# EAGLE design ACme++ (EAGLE 6.5.0)
AUTHOR: Brad Campbell; REV: A; TITLE: ACme++

## Sheet 1 of 4: EPIC & Programmer
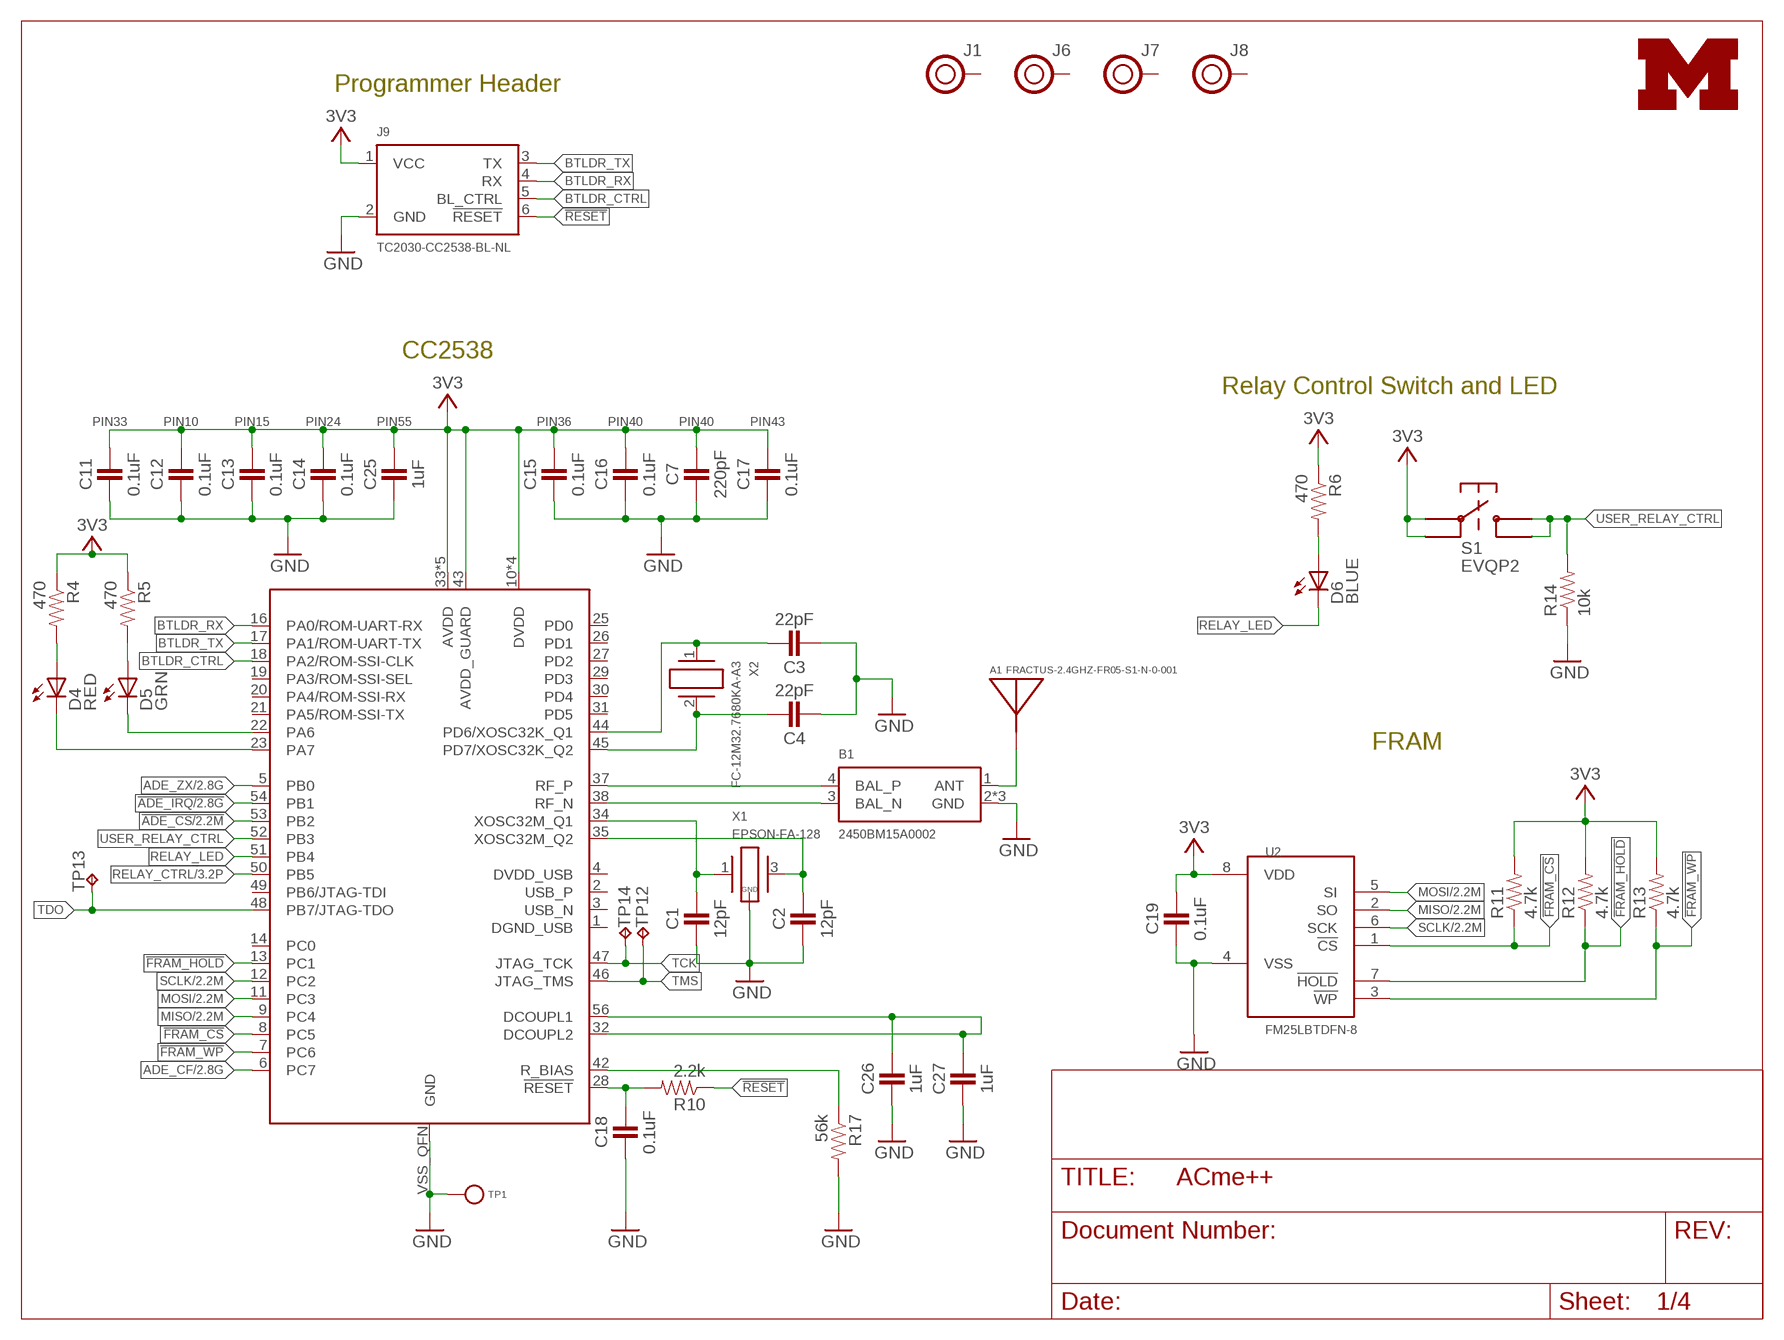
[diagram p0: schematic, sheet 1]

### Parts
A1  FRACTUS-2.4GHZ-FR05-S1-N-0-001  [FRACTUS-ANTENNA-FR05-S1-N-0-001]
B1  2450BM15A0002  [2450BM]
C1  12pF  CAPACITOR  [0402_CAP]
C2  12pF  CAPACITOR  [0402_CAP]
C3  22pF  CAPACITOR  [0402_CAP]
C4  22pF  CAPACITOR  [0402_CAP]
C7  220pF  CAPACITOR  [0402_CAP]
C11  0.1uF  CAPACITOR  [0402_CAP]
C12  0.1uF  CAPACITOR  [0402_CAP]
C13  0.1uF  CAPACITOR  [0402_CAP]
C14  0.1uF  CAPACITOR  [0402_CAP]
C15  0.1uF  CAPACITOR  [0402_CAP]
C16  0.1uF  CAPACITOR  [0402_CAP]
C17  0.1uF  CAPACITOR  [0402_CAP]
C18  0.1uF  CAPACITOR  [0402_CAP]
C19  0.1uF  CAPACITOR  [0402_CAP]
C25  1uF  CAPACITOR  [0402_CAP]
C26  1uF  CAPACITOR  [0402_CAP]
C27  1uF  CAPACITOR  [0402_CAP]
D4  RED  LED0603  [LED-0603]
D5  GRN  LED0603  [LED-0603]
D6  BLUE  LED0603  [LED-0603]
J1  HOLE  [HOLE-0.125]
J6  HOLE  [HOLE-0.125]
J7  HOLE  [HOLE-0.125]
J8  HOLE  [HOLE-0.125]
J9  TC2030-CC2538-BL-NL  [TC2030-IDC-NL]
R4  470  RESISTOR  [0402_RES]
R5  470  RESISTOR  [0402_RES]
R6  470  RESISTOR  [0402_RES]
R10  2.2k  RESISTOR  [0402_RES]
R11  4.7k  RESISTOR  [0402_RES]
R12  4.7k  RESISTOR  [0402_RES]
R13  4.7k  RESISTOR  [0402_RES]
R14  10k  RESISTOR0603-RES  [0603-RES]
R17  56k  RESISTOR  [0402_RES]
S1  EVQP2  [EVQP2]
TP1  TEST_POINT_0.040IN  [TESTPOINT_0.040IN]
TP12  TPTP09SQ  [TP09SQ]
TP13  TPTP09SQ  [TP09SQ]
TP14  TPTP09SQ  [TP09SQ]
U1  CC2538  [S-PVQFN-N56]
U2  FM25LBTDFN-8  [TDFN-8]
U$3  UMICH_SOLID_MEDIUM  [UMICH_SOLID_200MIL]
X1  EPSON-FA-128  [FA-128]
X2  FC-12M32.7680KA-A3  [FC-12M]

### Nets
3V3: C7.1 C11.1 C12.1 C13.1 C14.1 C15.1 C16.1 C17.1 C19.1 C25.1 J9.1(VCC) R4.1 R5.1 R6.1 R11.2 R12.2 R13.2 S1.P$1 S1.P$3 U1.10(DVDD) U1.15(DVDD) U1.24(DVDD) U1.33(AVDD) U1.36(AVDD) U1.39(AVDD) U1.40(AVDD) U1.41(AVDD) U1.43(AVDD_GUARD) U1.55(DVDD) U2.8(VDD) ; also sheet 2,3,4
!ADE_CS: U1.53(PB2) ; also sheet 2
!ADE_IRQ: U1.54(PB1) ; also sheet 2
!FRAM_CS: R11.1 U1.8(PC5) U2.1(!CS)
!FRAM_HOLD: R12.1 U1.13(PC1) U2.7(!HOLD)
!FRAM_WP: R13.1 U1.7(PC6) U2.3(!WP)
!RESET: J9.6(!RESET) R10.1
ADE_CF: U1.6(PC7) ; also sheet 2
ADE_ZX: U1.5(PB0) ; also sheet 2
ANTENNA: A1.1(ANTENNA) B1.1(ANT)
BTLDR_CTRL: J9.5(BL_CTRL) U1.18(PA2/ROM-SSI-CLK)
BTLDR_RX: J9.4(RX) U1.16(PA0/ROM-UART-RX)
BTLDR_TX: J9.3(TX) U1.17(PA1/ROM-UART-TX)
GND: B1.2(GND) B1.5(GND) B1.6(GND) C1.2 C2.2 C3.2 C4.2 C7.2 C11.2 C12.2 C13.2 C14.2 C15.2 C16.2 C17.2 C18.2 C19.2 C25.2 C26.2 C27.2 J9.2(GND) R14.1 R17.2 TP1.TESTPOINT U1.VSS_QFN(GND) U2.4(VSS) X1.2(GND) X1.4(GND) ; also sheet 2,3,4
GREEN_LED: D5.C U1.22(PA6)
MISO: U1.9(PC4) U2.2(SO) ; also sheet 2
MOSI: U1.11(PC3) U2.5(SI) ; also sheet 2
N$1: C26.1 C27.1 U1.32(DCOUPL2) U1.56(DCOUPL1)
N$2: C18.1 R10.2 U1.28(!RESET)
N$6: C4.1 U1.45(PD7/XOSC32K_Q2) X2.2
N$7: C3.1 U1.44(PD6/XOSC32K_Q1) X2.1
N$8: R17.1 U1.42(R_BIAS)
N$9: C1.1 U1.34(XOSC32M_Q1) X1.1
N$10: C2.1 U1.35(XOSC32M_Q2) X1.3
N$12: D6.A R6.2
N$20: D4.A R4.2
N$22: D5.A R5.2
RED_LED: D4.C U1.23(PA7)
RELAY_CTRL: U1.50(PB5) ; also sheet 3
RELAY_LED: D6.C U1.51(PB4)
RF_N: B1.3(BAL_N) U1.38(RF_N)
RF_P: B1.4(BAL_P) U1.37(RF_P)
SCLK: U1.12(PC2) U2.6(SCK) ; also sheet 2
TCK: TP14.TP U1.47(JTAG_TCK)
TDO: TP13.TP U1.48(PB7/JTAG-TDO)
TMS: TP12.TP U1.46(JTAG_TMS)
USER_RELAY_CTRL: R14.2 S1.P$2 S1.P$4 U1.52(PB3)
Unconnected: J1.1 J6.1 J7.1 J8.1 U1.1(DGND_USB) U1.2(USB_P) U1.3(USB_N) U1.4(DVDD_USB) U1.14(PC0) U1.19(PA3/ROM-SSI-SEL) U1.20(PA4/ROM-SSI-RX) U1.21(PA5/ROM-SSI-TX) U1.25(PD0) U1.26(PD1) U1.27(PD2) U1.29(PD3) U1.30(PD4) U1.31(PD5) U1.49(PB6/JTAG-TDI)

### Notes on the sheet
- Programmer Header
- CC2538
- Relay Control Switch and LED
- PIN33 | PIN10 | PIN15 | PIN24 | PIN55 | PIN36 | PIN40 | PIN40 | PIN43
- FRAM

## Sheet 2 of 4: ADE7753
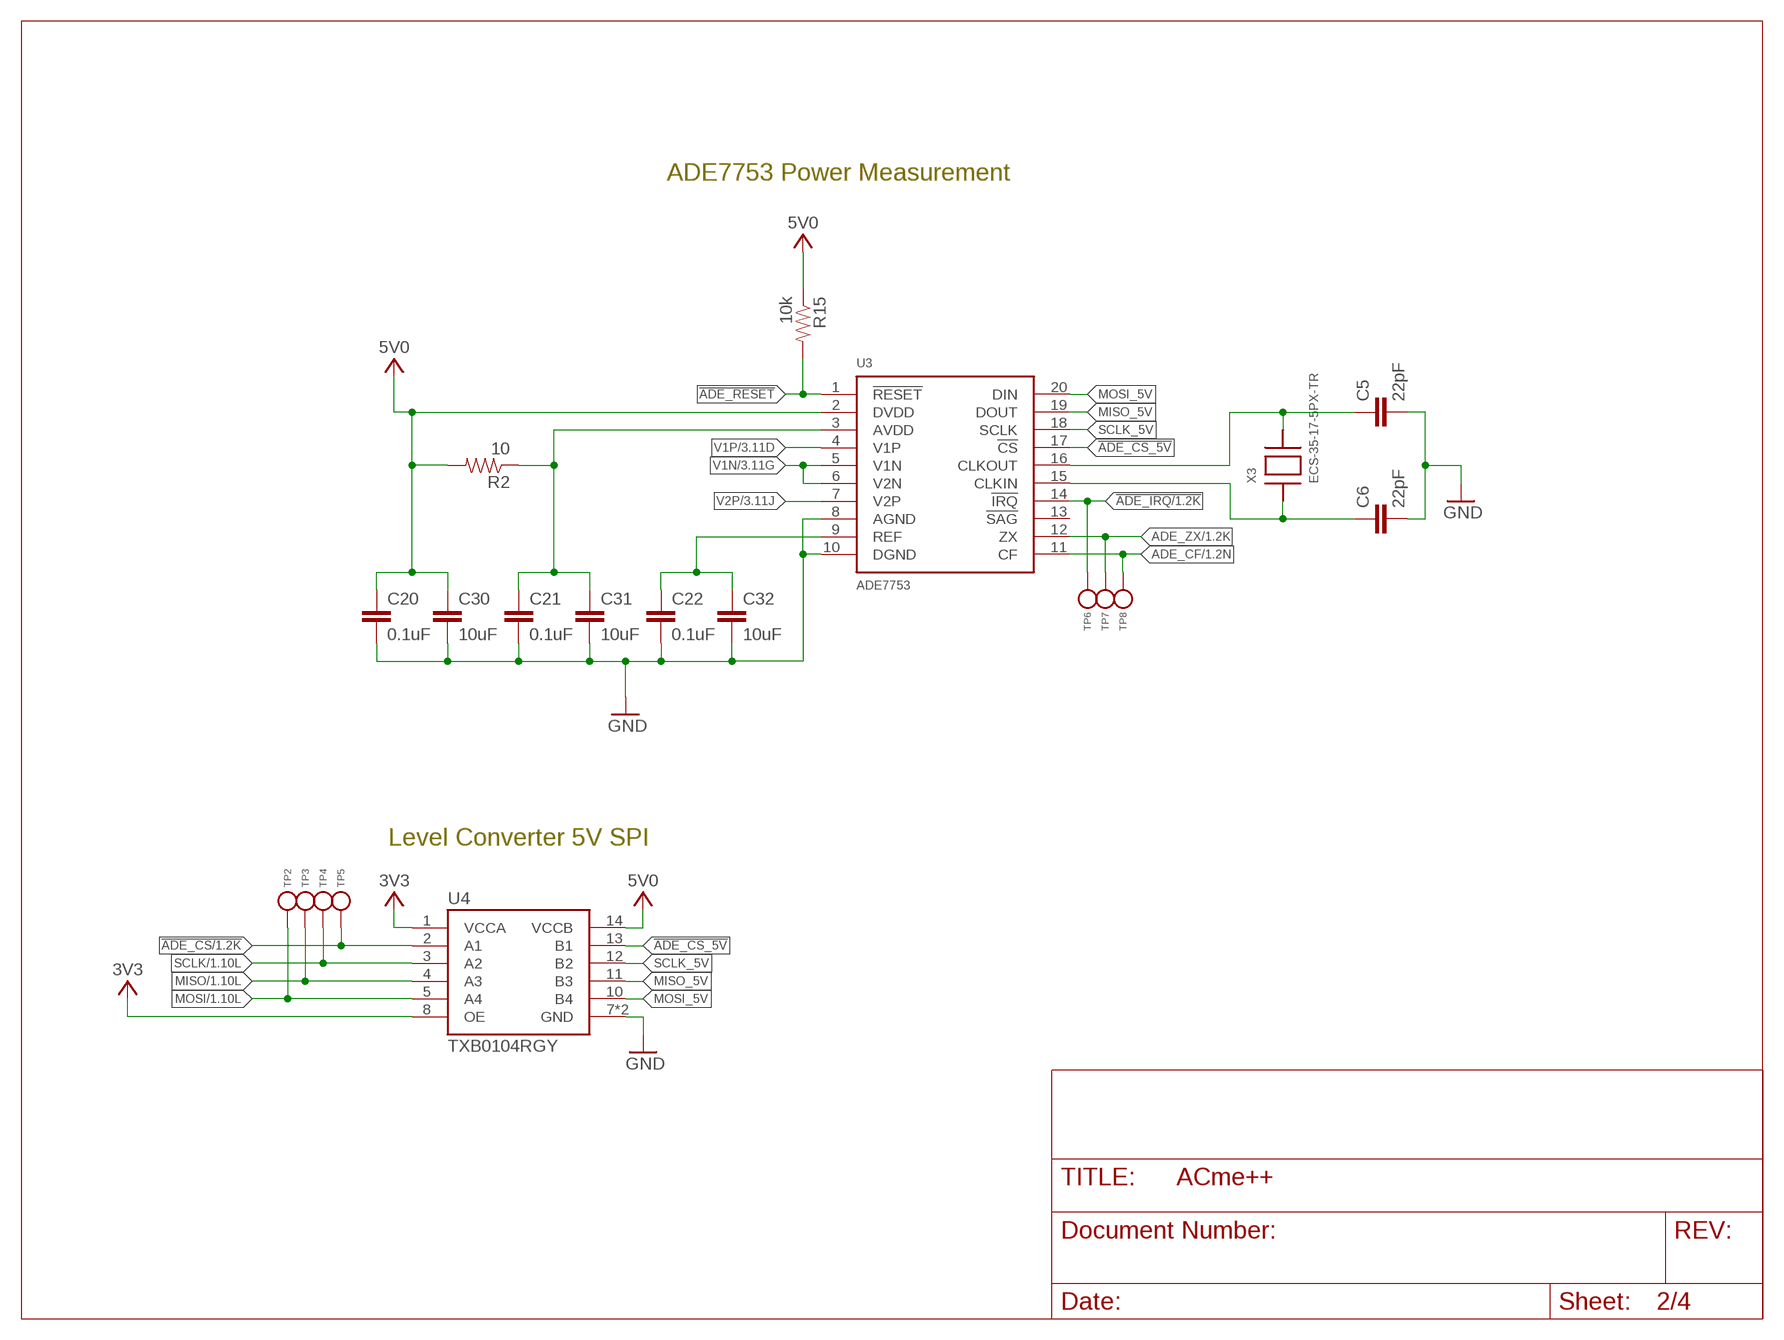
[diagram p1: schematic, sheet 2]

### Parts
C5  22pF  CAP0603-CAP  [0603-CAP]
C6  22pF  CAP0603-CAP  [0603-CAP]
C20  0.1uF  CAP0603-CAP  [0603-CAP]
C21  0.1uF  CAP0603-CAP  [0603-CAP]
C22  0.1uF  CAP0603-CAP  [0603-CAP]
C30  10uF  CAP0603-CAP  [0603-CAP]
C31  10uF  CAP0603-CAP  [0603-CAP]
C32  10uF  CAP0603-CAP  [0603-CAP]
R2  10  RESISTOR0603-RES  [0603-RES]
R15  10k  RESISTOR0603-RES  [0603-RES]
TP2  TEST_POINT_0.040IN  [TESTPOINT_0.040IN]
TP3  TEST_POINT_0.040IN  [TESTPOINT_0.040IN]
TP4  TEST_POINT_0.040IN  [TESTPOINT_0.040IN]
TP5  TEST_POINT_0.040IN  [TESTPOINT_0.040IN]
TP6  TEST_POINT_0.040IN  [TESTPOINT_0.040IN]
TP7  TEST_POINT_0.040IN  [TESTPOINT_0.040IN]
TP8  TEST_POINT_0.040IN  [TESTPOINT_0.040IN]
U3  ADE7753  [SSOP-20]
U4  TXB0104RGY  [S-PVQFN-N14]
X3  ECS-35-17-5PX-TR  [CSM-7X]

### Nets
3V3: U4.1(VCCA) U4.8(OE) ; also sheet 1,3,4
5V0: C20.1 C30.1 R2.2 R15.1 U3.2(DVDD) U4.14(VCCB) ; also sheet 3,4
!ADE_CS: TP5.TESTPOINT U4.2(A1) ; also sheet 1
!ADE_CS_5V: U3.17(!CS) U4.13(B1)
!ADE_IRQ: TP6.TESTPOINT U3.14(!IRQ) ; also sheet 1
!ADE_RESET: R15.2 U3.1(!RESET)
ADE_AVDD: C21.1 C31.1 R2.1 U3.3(AVDD)
ADE_CF: TP8.TESTPOINT U3.11(CF) ; also sheet 1
ADE_ZX: TP7.TESTPOINT U3.12(ZX) ; also sheet 1
GND: C5.2 C6.2 C20.2 C21.2 C22.2 C30.2 C31.2 C32.2 U3.8(AGND) U3.10(DGND) U4.7(GND) U4.THERMALPAD(GND) ; also sheet 1,3,4
MISO: TP3.TESTPOINT U4.4(A3) ; also sheet 1
MISO_5V: U3.19(DOUT) U4.11(B3)
MOSI: TP2.TESTPOINT U4.5(A4) ; also sheet 1
MOSI_5V: U3.20(DIN) U4.10(B4)
N$3: C6.1 U3.15(CLKIN) X3.1
N$11: C22.1 C32.1 U3.9(REF)
N$15: C5.1 U3.16(CLKOUT) X3.2
SCLK: TP4.TESTPOINT U4.3(A2) ; also sheet 1
SCLK_5V: U3.18(SCLK) U4.12(B2)
V1N: U3.5(V1N) U3.6(V2N) ; also sheet 3
V1P: U3.4(V1P) ; also sheet 3
V2P: U3.7(V2P) ; also sheet 3
Unconnected: U3.13(!SAG)

### Notes on the sheet
- ADE7753 Power Measurement
- Level Converter 5V SPI

## Sheet 3 of 4: Relay
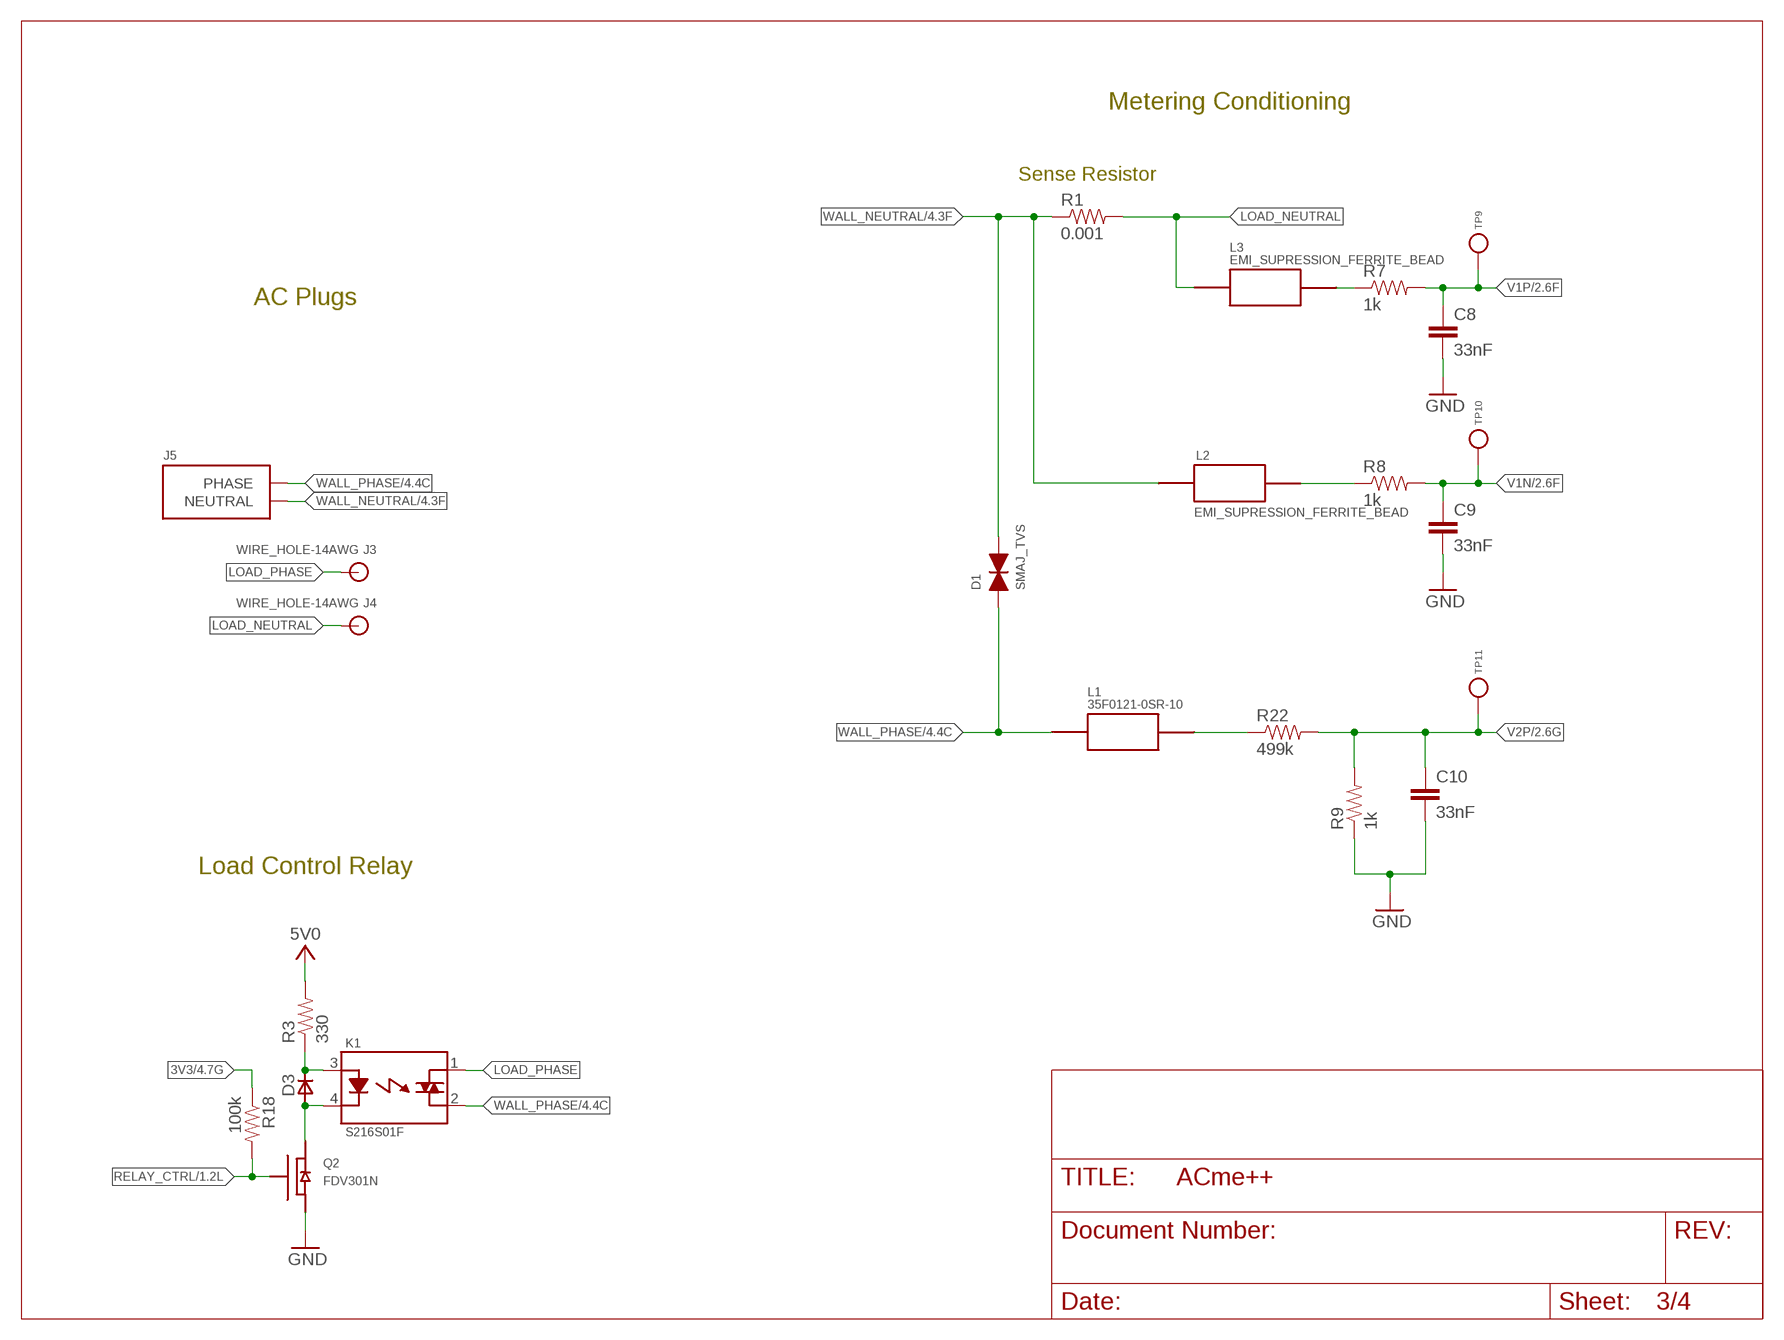
[diagram p2: schematic, sheet 3]

### Parts
C8  33nF  CAP0805  [0805]
C9  33nF  CAP0805  [0805]
C10  33nF  CAP0805  [0805]
D1  SMAJ_TVS  [DO214_TVS]
D3  DIODE_MMBD914  [SOT-23]
J3  WIRE_HOLE-14AWG  [WIRE_HOLE-14AWG]
J4  WIRE_HOLE-14AWG  [WIRE_HOLE-14AWG]
J5  AC-PLUG-2  [AC_MALE_PINS_2]
K1  S216S01F  [RELAY_SX16S0X]
L1  35F0121-0SR-10  [35F0102]
L2  EMI_SUPRESSION_FERRITE_BEAD  [L1806]
L3  EMI_SUPRESSION_FERRITE_BEAD  [L1806]
Q2  FDV301N  [SOT-23]
R1  0.001  RESISTOR2512  [R2512]
R3  330  RESISTOR0805-RES  [0805]
R7  1k  RESISTOR0805-RES  [0805]
R8  1k  RESISTOR0805-RES  [0805]
R9  1k  RESISTOR0805-RES  [0805]
R18  100k  RESISTOR0603-RES  [0603-RES]
R22  499k  RESISTOR0805-RES  [0805]
TP9  TEST_POINT_0.040IN  [TESTPOINT_0.040IN]
TP10  TEST_POINT_0.040IN  [TESTPOINT_0.040IN]
TP11  TEST_POINT_0.040IN  [TESTPOINT_0.040IN]

### Nets
3V3: R18.1 ; also sheet 1,2,4
5V0: R3.2 ; also sheet 2,4
GND: C8.2 C9.2 C10.2 Q2.2(S) R9.1 ; also sheet 1,2,4
LOAD_NEUTRAL: J4.P$1 L3.P$1 R1.2
LOAD_PHASE: J3.P$1 K1.1
N$4: D3.1(ANNODE) K1.4 Q2.3(D)
N$13: D3.3(CATHODE) K1.3 R3.1
N$14: L2.P$2 R8.1
N$16: L3.P$2 R7.1
N$17: L1.2 R22.1
RELAY_CTRL: Q2.1(G) R18.2 ; also sheet 1
V1N: C9.1 R8.2 TP10.TESTPOINT ; also sheet 2
V1P: C8.1 R7.2 TP9.TESTPOINT ; also sheet 2
V2P: C10.1 R9.2 R22.2 TP11.TESTPOINT ; also sheet 2
WALL_NEUTRAL: D1.CATHODE J5.NEUTRAL1(NEUTRAL) J5.NEUTRAL2(NEUTRAL) L2.P$1 R1.1 ; also sheet 4
WALL_PHASE: D1.ANODE J5.PHASE1(PHASE) J5.PHASE2(PHASE) K1.2 L1.1 ; also sheet 4

### Notes on the sheet
- Metering Conditioning
- Sense Resistor
- AC Plugs
- Load Control Relay

## Sheet 4 of 4: AC-DC
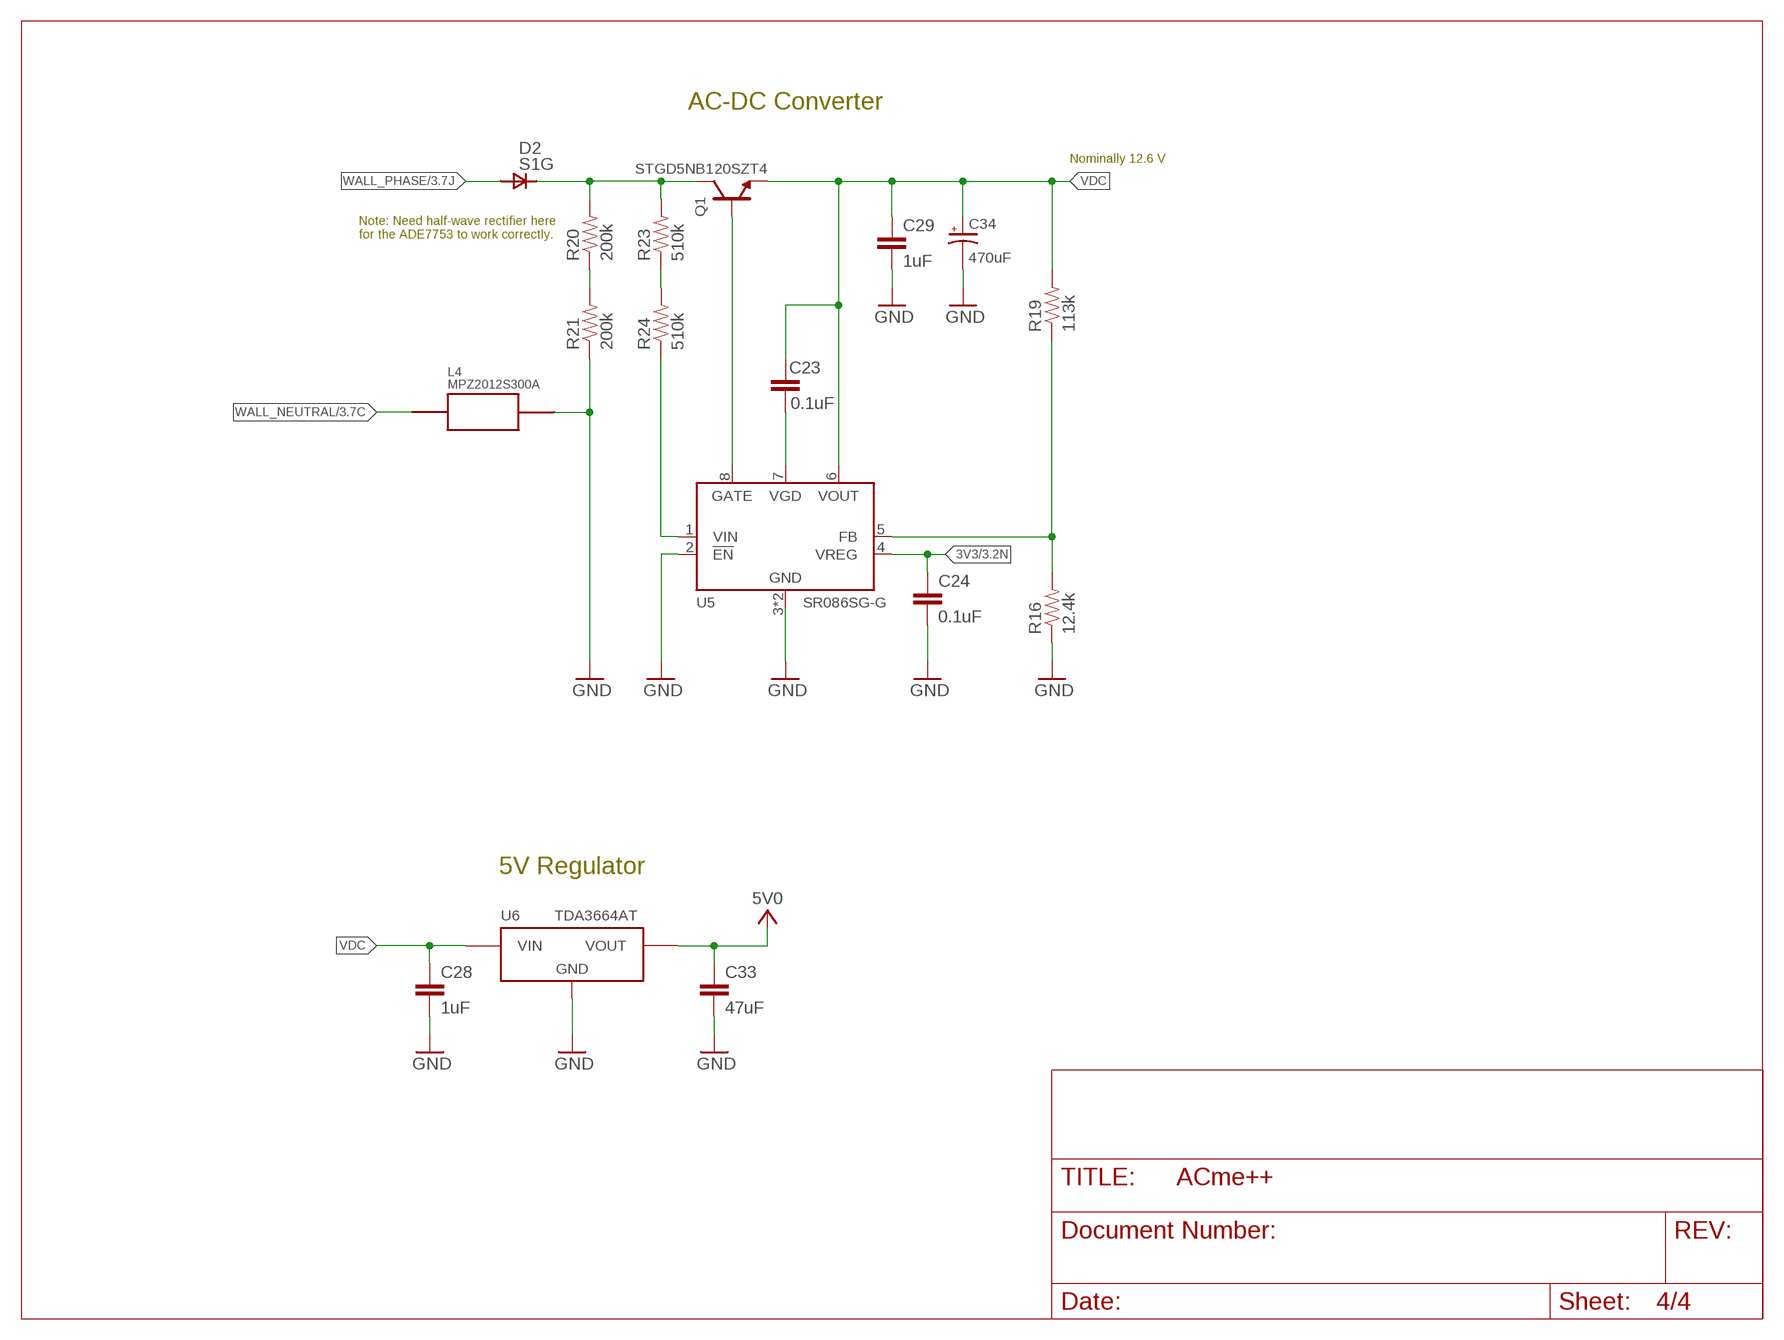
[diagram p3: schematic, sheet 4]

### Parts
C23  0.1uF  CAP0603-CAP  [0603-CAP]
C24  0.1uF  CAP0603-CAP  [0603-CAP]
C28  1uF  CAP0603-CAP  [0603-CAP]
C29  1uF  CAP1206  [1206]
C33  47uF  CAP1206  [1206]
C34  470uF  CAP_EEE-FP1E471AP  [CAP_SM_10MM]
D2  S1G  [DO-214AC]
L4  MPZ2012S300A  [0805_RESISTOR]
Q1  STGD5NB120SZT4  [DPAK]
R16  12.4k  RESISTOR0603-RES  [0603-RES]
R19  113k  RESISTOR0603-RES  [0603-RES]
R20  200k  RESISTOR1206  [1206]
R21  200k  RESISTOR1206  [1206]
R23  510k  RESISTOR1206  [1206]
R24  510k  RESISTOR1206  [1206]
U5  SR086SG-G  [SR086]
U6  TDA3664AT  [SOIC_8]

### Nets
3V3: C24.1 U5.4(VREG) ; also sheet 1,2,3
5V0: C33.1 U6.1(VOUT) ; also sheet 2,3
DC_RECTIFIED: D2.CATHODE Q1.P$2(C) R20.2 R23.2
GND: C24.2 C28.2 C29.2 C33.2 C34.- L4.P$2 R16.1 R21.1 U5.2(!EN) U5.3(GND) U5.PAD(GND) U6.3(GND) ; also sheet 1,2,3
N$18: R20.1 R21.2
N$21: R23.1 R24.2
N$24: C23.2 U5.7(VGD)
N$26: R16.2 R19.1 U5.5(FB)
SR086_GATE: Q1.P$1(G) U5.8(GATE)
SR086_VIN: R24.1 U5.1(VIN)
VDC: C23.1 C28.1 C29.1 C34.+ Q1.P$3(E) R19.2 U5.6(VOUT) U6.8(VIN)
WALL_NEUTRAL: L4.P$1 ; also sheet 3
WALL_PHASE: D2.ANNODE ; also sheet 3

### Notes on the sheet
- AC-DC Converter
- Nominally 12.6 V
- Note: Need half-wave rectifier here
  for the ADE7753 to work correctly.
- 5V Regulator

## Library data of the parts
A1 = chips:FRACTUS-2.4GHZ-FR05-S1-N-0-001: Fractus Reach Xtend Bluetooth®, Zigbee®, 802.11 b/g/n WLAN Chip Antenna; RICHARDSON_RFPD: FR05-S1-N-0001B
B1 = chips:2450BM15A0002: BALUN JTI MATCHED ZIGBEE; DIGIKEY: 712-1536-1-ND
C1 C2 = passives:CAPACITOR: 0402 Capacitor; DIGIKEY: 445-1236-1-ND
C3 C4 = passives:CAPACITOR: 0402 Capacitor; DIGIKEY: 490-5868-1-ND
C5 C6 = SparkFun-Passives:CAP: Capacitor Standard 0603 ceramic capacitor, and 0.1" leaded capacitor.; DIGIKEY: 445-1273-1-ND
C7 = passives:CAPACITOR: 0402 Capacitor; DIGIKEY: 445-1251-1-ND
C8-C10 = SparkFun-Passives:CAP: Capacitor Standard 0603 ceramic capacitor, and 0.1" leaded capacitor.; DIGIKEY: 478-1389-1-ND
C11-C19 = passives:CAPACITOR: 0402 Capacitor; DIGIKEY: 445-1265-1-ND
C20-C24 = SparkFun-Passives:CAP: Capacitor Standard 0603 ceramic capacitor, and 0.1" leaded capacitor.; DIGIKEY: 445-1316-1-ND
C25-C27 = passives:CAPACITOR: 0402 Capacitor; DIGIKEY: 445-4998-1-ND
C28 = SparkFun-Passives:CAP: Capacitor Standard 0603 ceramic capacitor, and 0.1" leaded capacitor.; DIGIKEY: 445-5956-1-ND
C29 = SparkFun-Passives:CAP: Capacitor Standard 0603 ceramic capacitor, and 0.1" leaded capacitor.; DIGIKEY: 445-1381-1-ND
C30-C32 = SparkFun-Passives:CAP: Capacitor Standard 0603 ceramic capacitor, and 0.1" leaded capacitor.; DIGIKEY: 1276-1119-1-ND
C33 = SparkFun-Passives:CAP: Capacitor Standard 0603 ceramic capacitor, and 0.1" leaded capacitor.; DIGIKEY: 399-5508-1-ND
C34 = powercube:CAP_EEE-FP1E471AP: Surface mount low ESR cap.; DIGIKEY: PCE4440CT-ND
D1 = powercube:SMAJ_TVS; DIGIKEY: SMAJ250CALFCT-ND
D2 = powercube:S1G: Diode 400V 1A SMA; DIGIKEY: S1GFSCT-ND
D3 = powercube:DIODE_MMBD914: DIODE SML SIG 100V 0.2A SOT23-3; DIGIKEY: MMBD914FSCT-ND
D4 = SparkFun-LED:LED: LEDs Standard schematic elements and footprints for 5mm, 3mm, 1206, and 0603 sized LEDs. 5mm - Spark Fun Electronics SKU : COM-00529 (and others); DIGIKEY: 160-1835-1-ND
D5 = SparkFun-LED:LED: LEDs Standard schematic elements and footprints for 5mm, 3mm, 1206, and 0603 sized LEDs. 5mm - Spark Fun Electronics SKU : COM-00529 (and others); DIGIKEY: 160-1834-1-ND
D6 = SparkFun-LED:LED: LEDs Standard schematic elements and footprints for 5mm, 3mm, 1206, and 0603 sized LEDs. 5mm - Spark Fun Electronics SKU : COM-00529 (and others); DIGIKEY: 160-1837-1-ND
J1 J6-J8 = powercube:HOLE: 0.125" PCB Hole with ring
J3 J4 = powercube:WIRE_HOLE-14AWG: Solder point for 14AWG wire
J5 = powercube:AC-PLUG-2: For use with Bud Industries Box: 377-1709-ND
J9 = connector:TC2030-CC2538-BL: Tag connect programmer for the CC2538 bootloader. The RX/TX switch happens on the programmer board, so when using this connect the TX pin to the TX pin on the CC2538 and same for the RX.
K1 = powercube:S216S01F: RELAY SSR 240VAC 16A TRIAC 4-SIP; DIGIKEY: 425-2413-5-ND; MOUSER: 852-S216S01F; NEWARK: 14N9591
L1 = powercube:35F0121-0SR-10: FERRITE 10A 42 OHMS @ 10 MHZ SMD; DIGIKEY: 240-2520-1-ND
L2 L3 = powercube:EMI_SUPRESSION_FERRITE_BEAD: FERRITE 300MA 150 OHM 1806 SMD; DIGIKEY: 240-2418-1-ND
L4 = powercube:MPZ2012S300A: FERRITE CHIP 30 OHM 6A 0805; DIGIKEY: 445-1566-1-ND
Q1 = powercube:STGD5NB120SZ: 5 A - 1200 V - low drop internally clamped IGBT; DIGIKEY: 497-4352-1-ND
Q2 = powercube:FDV301N; DIGIKEY: FDV301NCT-ND
R1 = SparkFun-Resistors:RESISTOR: Resistor; DIGIKEY: P1.0TCT-ND
R2 = SparkFun:RESISTOR: Resistor; DIGIKEY: RHM10.0CFCT-ND
R3 = SparkFun-Resistors:RESISTOR: Resistor; DIGIKEY: RHM330KCT-ND
R4-R6 = passives:RESISTOR: Resistor; DIGIKEY: RHM470BHCT-ND
R7-R9 = SparkFun-Resistors:RESISTOR: Resistor; DIGIKEY: P16058CT-ND
R10 = passives:RESISTOR: Resistor; DIGIKEY: RHM2.2KCECT-ND
R11-R13 = passives:RESISTOR: Resistor; DIGIKEY: RHM4.7KCECT-ND
R14 R15 = SparkFun:RESISTOR: Resistor; DIGIKEY: RHM10.0KCFCT-ND
R16 = SparkFun-Resistors:RESISTOR: Resistor; DIGIKEY: RHM12.4KCFCT-ND
R17 = passives:RESISTOR: Resistor; DIGIKEY: RHM56KBHCT-ND
R18 = SparkFun:RESISTOR: Resistor; DIGIKEY: RHM100KCGCT-ND
R19 = SparkFun-Resistors:RESISTOR: Resistor; DIGIKEY: RHM113KCFCT-ND
R20 R21 = SparkFun-Resistors:RESISTOR: Resistor; DIGIKEY: P200KALCT-ND
R22 = SparkFun-Resistors:RESISTOR: Resistor; DIGIKEY: P499KCCT-ND
R23 R24 = SparkFun-Resistors:RESISTOR: Resistor; DIGIKEY: P510KALCT-ND
S1 = epic:EVQP2; DIGIKEY: P11084SCT-ND
TP1-TP11 = headers:TEST_POINT_0.040IN: 0.040in Test Point; DIGIKEY: 5001K-ND
TP12-TP14 = testpad:TP: Test pad
U1 = chips:CC2538: A Powerful System-On-Chip for 2.4-GHz IEEE 802.15.4, 6LoWPAN and ZigBee Applications; DIGIKEY: 296-35797-1-ND; MOUSER: 595-CC2538SF53RTQT; NEWARK: 87W7713
U2 = chips:FM25LB: IC FRAM 4KBIT 10MHZ 8SOIC; DIGIKEY: FM25L04B-DGRA-ND; MOUSER: 877-FM25L04B-DG
U3 = powercube:ADE7753: Single-Phase Multifunction Metering IC; DIGIKEY: ADE7753ARSZRLCT-ND; MOUSER: 584-ADE7753ARSZR; NEWARK: 59K0984
U4 = chips:TXB0104: 4-BIT BIDIRECTIONAL VOLTAGE-LEVEL TRANSLATOR; DIGIKEY: 296-21930-1-ND
U5 = powercube:SR086: Adjustable Off-Line Inductorless Switching Regulator; MOUSER: 689-SR086SG-G
U6 = powercube:TDA3664: Very low dropout voltage/quiescent current 5 V voltage regulator; DIGIKEY: 568-3310-1-ND; MOUSER: 771-TDA3664ATN1118
U$3 = logos:UMICH_SOLID
X1 = crystals:EPSON-FA-128: MHz RANGE CRYSTAL UNIT ULTRA MINIATURE SIZE LOW PROFILE SMD http://www.digikey.com/product-search/en?FV=ffec63d1; DIGIKEY: SER3800CT-ND; MOUSER: 732-FA128-32F20X-K3
X2 = crystals:FC-12M: kHz RANGE CRYSTAL UNIT; DIGIKEY: SER3672CT-ND
X3 = powercube:ECS-35-17-5PX-TR: CRYSTAL 3.579545MHZ 17PF SMD; DIGIKEY: XC1234CT-ND

## Net classes
1 ac phase: width 2.032 mm, drill 1.524 mm

## Board
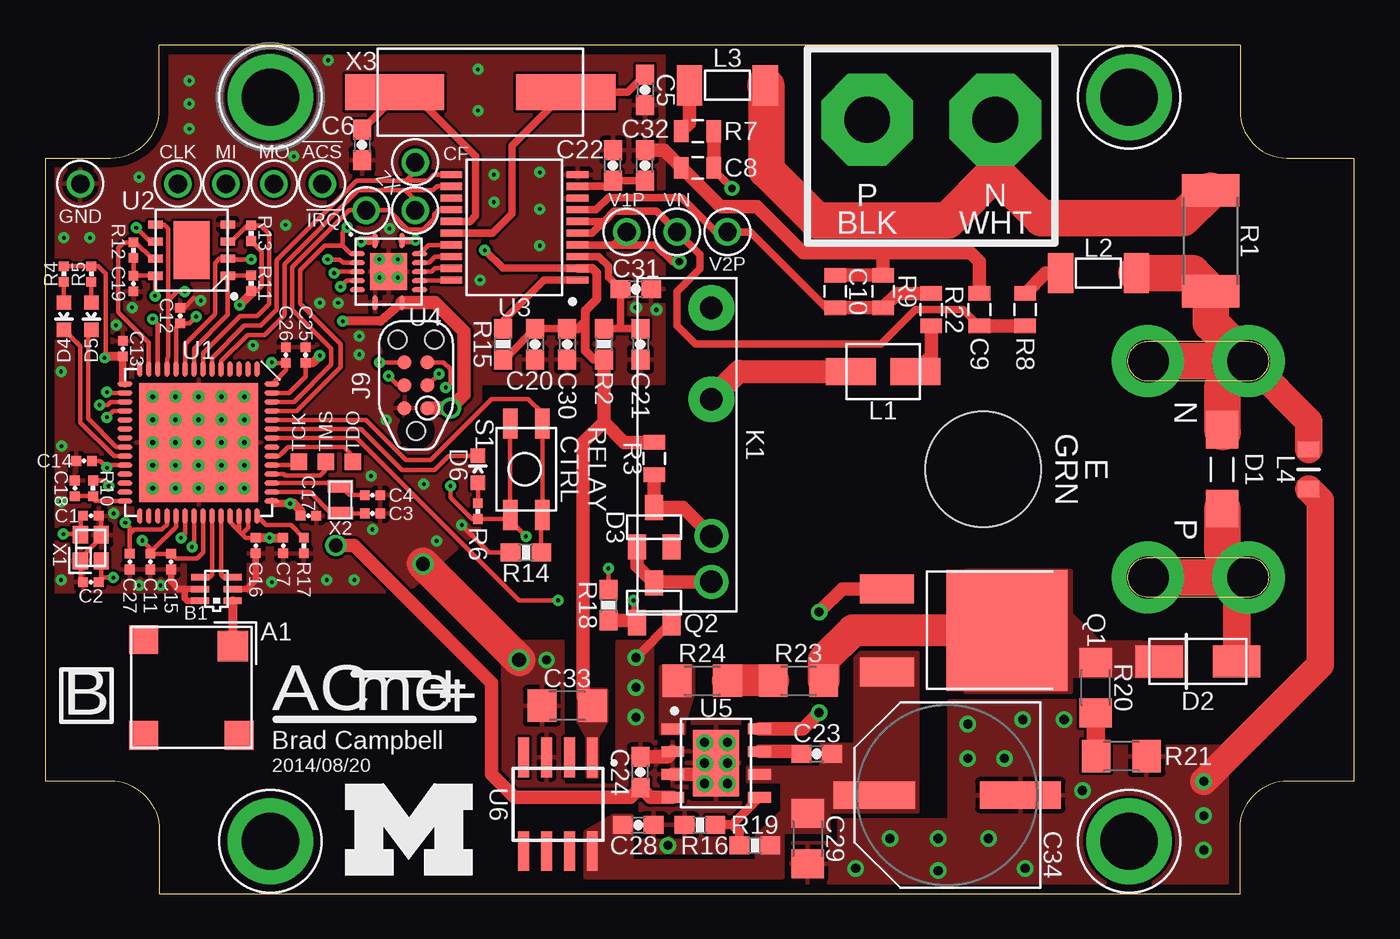
[diagram p4: board, top side]
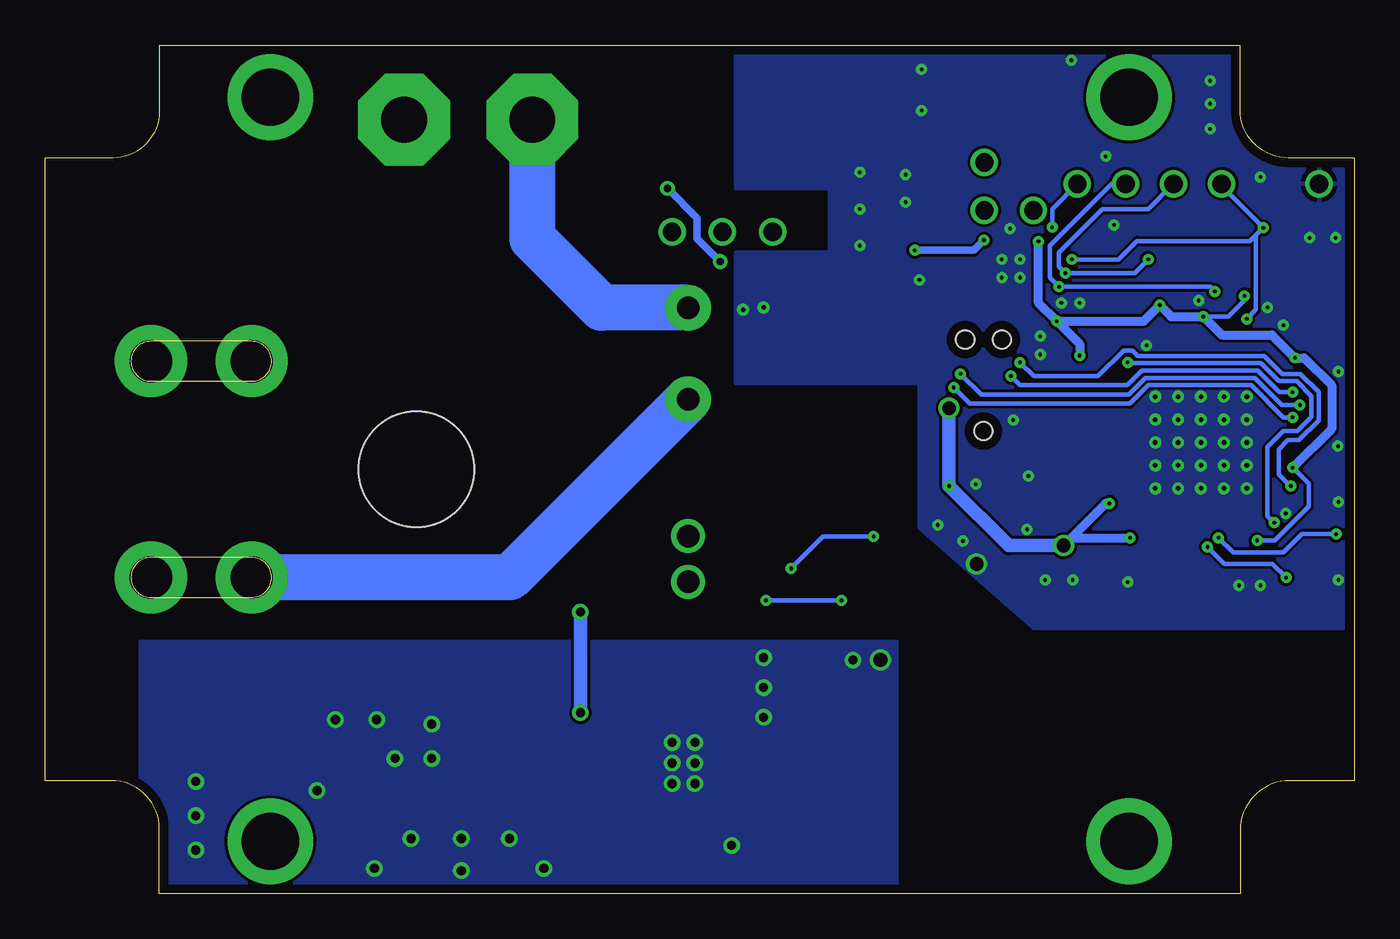
[diagram p5: board, bottom side, seen from below]

Size 72.62 x 47.07 mm. Coordinates in mm from the lower left corner, seen from the top.
Outline: 6.34,0 66.28,0 66.28,3.6 arc-90 68.94,6.26 72.62,6.26 72.62,40.8 68.87,40.8 arc-90 66.28,43.39 66.28,47.07 6.34,47.07 6.34,43.49 arc-90 3.65,40.8 0,40.8 0,6.26 3.58,6.26 arc-90 6.34,3.51 6.34,0
Copper layers (1*16): Top 0.0178mm / dielectric 59mil / Bottom 0.0178mm
Design rules "sunstone-2lyr_v1.0.0.3 *": minimum track width 6mil, minimum drill 14mil, track to track 6mil, track to pad 6mil, pad to pad 6mil, via to via 6mil, smd to smd 6mil, copper to edge 20mil, drill to drill 16mil, minimum pad ring 8mil, minimum via ring 8mil, stop-mask expansion 3mil, vias tented up to drill 100mil, thermal gap 10mil

### Footprints (pad centres in the part's own frame; a part is rotated, then mirrored left to right if it is on the bottom)
FRACTUS-ANTENNA-FR05-S1-N-0-001 = smd 1.7 x 1.7: 1 2.3,-2.3 | smd 1.6 x 1.6: 2 2.65,2.65; 3 -2.65,-2.65; 4 -2.65,2.65
2450BM = smd 0.35 x 1: 1 0.65,0.9; 2 0,0.9; 3 -0.65,0.9; 4 -0.65,-0.9; 5 0,-0.9; 6 0.65,-0.9
0402_CAP = smd 0.536 x 0.546: 1 -0.433,0; 2 0.433,0
0603-CAP = smd 1.1 x 1: 1 -0.85,0; 2 0.85,0
0805 = smd 0.8 x 1.2: 1 -0.9,0; 2 0.9,0
1206 = smd 1.6 x 1.8: 1 -1.4,0; 2 1.4,0
CAP_SM_10MM = smd 1.5 x 4.5: + 0,4.05; - 0,-4.05
DO214_TVS = smd 2.083 x 1.778: ANODE 2.184,0; CATHODE -2.184,0
DO-214AC = smd 2.65 x 1.75: ANNODE -2.15,0; CATHODE 2.15,0
SOT-23 = smd 1 x 1.4: 1 -0.95,-1.1; 2 0.95,-1.1; 3 0,1.1
LED-0603 = smd 0.8 x 0.8: A 0,-0.75; C 0,0.75
HOLE-0.125 = drill 3.175 pad 4.572: 1 0,0
WIRE_HOLE-14AWG = drill 2.54 pad 5.08 octagon: P$1 0,0
AC_MALE_PINS_2 = drill 2.34 pad 4: NEUTRAL1 -2.79,-5.995; NEUTRAL2 2.79,-5.995; PHASE1 -2.79,5.995; PHASE2 2.79,5.995 | hole 6.426: 11.938,0
TC2030-IDC-NL = smd 0.787 x 0.787: 1 -1.27,-0.635; 2 -1.27,0.635; 3 0,-0.635; 4 0,0.635; 5 1.27,-0.635; 6 1.27,0.635 | hole 1.016: -2.54,0; 2.54,1.016; 2.54,-1.016
RELAY_SX16S0X = drill 1.25 pad 2.54: 1 -7.602,0; 2 -2.522,0 | drill 1.25: 3 5.062,0; 4 7.602,0
35F0102 = smd 2.769 x 1.473: 1 -1.791,0; 2 1.791,0
L1806 = smd 1.4 x 2.24: P$1 -2.1,0; P$2 2.1,0
0805_RESISTOR = smd 0.9 x 1.2: P$1 -1.1,0; P$2 1.1,0
DPAK = smd 1.6 x 3: P$1 -2.3,-6.65; P$3 2.3,-6.65 | smd 6.7 x 6.7: P$2 0,0
R2512 = smd 1.8 x 3.2: 1 -2.8,0; 2 2.8,0
0603-RES = smd 1.1 x 1: 1 -0.85,0; 2 0.85,0
0402_RES = smd 0.536 x 0.546: 1 -0.433,0; 2 0.433,0
EVQP2 = smd 1.676 x 0.813: P$1 -2.54,-0.87; P$2 -2.54,0.908; P$3 2.54,-0.87; P$4 2.54,0.908
TESTPOINT_0.040IN = drill 1.016: TESTPOINT 0,0
TP09SQ = smd 0.9 x 0.9: TP 0,0
S-PVQFN-N56 = smd 0.85 x 0.28: 1 -4.075,3.25; 2 -4.075,2.75; 3 -4.075,2.25; 4 -4.075,1.75; 5 -4.075,1.25; 6 -4.075,0.75; 7 -4.075,0.25; 8 -4.075,-0.25; 9 -4.075,-0.75; 10 -4.075,-1.25; 11 -4.075,-1.75; 12 -4.075,-2.25; 13 -4.075,-2.75; 14 -4.075,-3.25; 29 4.075,-3.25; 30 4.075,-2.75; 31 4.075,-2.25; 32 4.075,-1.75; 33 4.075,-1.25; 34 4.075,-0.75; 35 4.075,-0.25; 36 4.075,0.25; 37 4.075,0.75; 38 4.075,1.25; 39 4.075,1.75; 40 4.075,2.25; 41 4.075,2.75; 42 4.075,3.25 | smd 0.28 x 0.85: 15 -3.25,-4.075; 16 -2.75,-4.075; 17 -2.25,-4.075; 18 -1.75,-4.075; 19 -1.25,-4.075; 20 -0.75,-4.075; 21 -0.25,-4.075; 22 0.25,-4.075; 23 0.75,-4.075; 24 1.25,-4.075; 25 1.75,-4.075; 26 2.25,-4.075; 27 2.75,-4.075; 28 3.25,-4.075; 43 3.25,4.075; 44 2.75,4.075; 45 2.25,4.075; 46 1.75,4.075; 47 1.25,4.075; 48 0.75,4.075; 49 0.25,4.075; 50 -0.25,4.075; 51 -0.75,4.075; 52 -1.25,4.075; 53 -1.75,4.075; 54 -2.25,4.075; 55 -2.75,4.075; 56 -3.25,4.075 | smd 6.6 x 6.6: VSS_QFN 0,0
TDFN-8 = smd 0.45 x 0.8: 1 -1.425,-2.007; 2 -0.475,-2.007; 3 0.475,-2.007; 4 1.425,-2.007; 5 1.425,2.007; 6 0.475,2.007; 7 -0.475,2.007; 8 -1.425,2.007 | smd 3.2 x 2: NC 0,0
SSOP-20 = smd 1.2 x 0.4: 1 -3.5,2.925; 2 -3.5,2.275; 3 -3.5,1.625; 4 -3.5,0.975; 5 -3.5,0.325; 6 -3.5,-0.325; 7 -3.5,-0.975; 8 -3.5,-1.625; 9 -3.5,-2.275; 10 -3.5,-2.925; 11 3.5,-2.925; 12 3.5,-2.275; 13 3.5,-1.625; 14 3.5,-0.975; 15 3.5,-0.325; 16 3.5,0.325; 17 3.5,0.975; 18 3.5,1.625; 19 3.5,2.275; 20 3.5,2.925
S-PVQFN-N14 = smd 0.28 x 0.85: 1 -0.75,1.725; 7 -0.75,-1.725; 8 0.75,-1.725; 14 0.75,1.725 | smd 0.85 x 0.28: 2 -1.725,1; 3 -1.725,0.5; 4 -1.725,0; 5 -1.725,-0.5; 6 -1.725,-1; 9 1.725,-1; 10 1.725,-0.5; 11 1.725,0; 12 1.725,0.5; 13 1.725,1 | smd 2.05 x 2.05: THERMALPAD 0,0
SR086 = smd 1.27 x 0.6: 1 -2.4,1.905; 2 -2.4,0.635; 3 -2.4,-0.635; 4 -2.4,-1.905; 5 2.4,-1.905; 6 2.4,-0.635; 7 2.4,0.635; 8 2.4,1.905 | smd 2.55 x 3.7: PAD 0,0
SOIC_8 = smd 2.2 x 0.6: 1 -2.6,1.905; 2 -2.6,0.635; 3 -2.6,-0.635; 4 -2.6,-1.905; 5 2.6,-1.905; 6 2.6,-0.635; 7 2.6,0.635; 8 2.6,1.905
FA-128 = smd 0.95 x 0.85: 1 -0.725,-0.575; 2 0.725,-0.575; 3 0.725,0.575; 4 -0.725,0.575
FC-12M = smd 0.7 x 1.4: 1 -0.75,0; 2 0.75,0
CSM-7X = smd 5.5 x 2: 1 -4.75,0; 2 4.75,0

### Placement (x,y rotation side)
A1  8.12,11.43 90 top
B1  9.51,16.89 270 top
C1  2.54,20.95 0 top
C2  2.54,17.27 180 top
C3  18.16,21.08 0 top
C4  18.16,22.1 0 top
C5  33.27,44.58 270 top
C6  17.58,41.53 270 top
C7  13.21,19.3 270 top
C8  36.2,40.26 180 top
C9  51.82,32.38 90 top
C10  43.81,33.4 90 top
C11  5.84,18.41 270 top
C12  7.49,32.05 90 top
C13  4.32,30.23 90 top
C14  2.16,24 180 top
C15  6.99,18.41 270 top
C16  11.68,19.3 270 top
C17  14.61,20.95 0 top
C18  1.65,22.48 90 top
C19  4.9,33.83 270 top
C20  27.18,30.48 270 top
C21  33.02,30.48 270 top
C22  31.5,40.39 90 top
C23  42.8,7.75 180 top
C24  33.02,6.73 90 top
C25  14.45,29.87 90 top
C26  13.36,29.87 90 top
C27  4.7,18.41 270 top
C28  32.89,3.81 0 top
C29  42.29,3.05 270 top
C30  28.96,30.48 270 top
C31  32.77,33.53 0 top
C32  33.27,40.39 90 top
C33  28.96,10.41 180 top
C34  50.04,5.46 90 top
D1  65.28,23.53 270 top
D2  63.93,12.88 180 top
D3  33.78,20.32 0 top
D4  1.04,32.03 180 top
D5  2.57,32.03 180 top
D6  24,23.53 0 top
J1  12.5,44.17 0 top
J3  45.59,42.93 90 top
J4  52.7,42.93 90 top
J5  63.96,23.53 180 top
J6  12.5,2.9 0 top
J7  60.12,2.9 0 top
J8  60.12,44.17 0 top
J9  20.57,28.19 90 top
K1  36.96,24.89 270 top
L1  46.48,28.96 0 top
L2  58.42,34.42 180 top
L3  37.85,44.83 180 top
L4  70.08,23.53 270 top
Q1  53.34,14.61 270 top
Q2  33.78,16.13 0 top
R1  64.64,36.2 90 top
R2  30.99,30.48 270 top
R3  33.78,24.13 90 top
R4  1.04,34.37 270 top
R5  2.57,34.37 270 top
R6  24,21.21 90 top
R7  36.2,42.29 0 top
R8  54.36,32.38 270 top
R9  46.48,33.4 270 top
R10  2.67,22.48 270 top
R11  11.43,33.86 270 top
R12  4.9,35.69 270 top
R13  11.43,36.63 270 top
R14  26.67,18.92 0 top
R15  25.4,30.48 90 top
R16  36.32,3.81 0 top
R17  14.35,19.3 270 top
R18  31.24,16 270 top
R19  39.37,2.67 0 top
R20  58.27,11.43 90 top
R21  59.69,7.62 180 top
R22  49.15,32.38 90 top
R23  41.78,11.81 0 top
R24  36.45,11.81 0 top
S1  26.67,23.53 270 top
TP1  1.96,39.37 0 top
TP2  12.7,39.37 0 top
TP3  10.03,39.37 0 top
TP4  7.37,39.37 0 top
TP5  15.37,39.37 0 top
TP6  17.81,37.9 0 top
TP7  20.52,37.9 0 top
TP8  20.52,40.56 0 top
TP9  32.26,36.7 0 top
TP10  35.05,36.7 0 top
TP11  37.85,36.7 0 top
TP12  15.57,23.95 0 top
TP13  17.07,23.95 0 top
TP14  14.07,23.95 0 top
U1  8.51,25.02 270 top
U2  8.13,35.69 90 top
U3  26.04,36.96 180 top
U4  19.05,34.49 0 top
U5  37.21,7.24 0 top
U6  28.45,4.95 270 top
U$3  16.64,1.02 0 top
X1  2.54,19.18 270 top
X2  16.38,21.84 90 top
X3  24.13,44.45 0 top

### Tracks (layer width: path | path; a pad name or v marks a point on that pad's centre or on a via)
3V3  (via drill 0.2, 0.76)
  Top 0.254: U1.36 8.76,18.92 8.43,18.59 7.24,18.59 C15.1 C11.1 | U1.33 7.26,20.34 6.02,19.1 C11.1 | C16.1 11.12,19.74 10.92,19.94 | 10.92,19.94 10.76,20.1 | 10.76,20.1 U1.40 | U1.41 11.26,20.28 10.92,19.94 | U1.39 10.26,20.6 10.76,20.1 | U1.55 13.54,27.77 14.45,28.68 C25.1 | U1.10 7.26,31.39 C12.1 8,31.62 v8.38,32 | v6.1,33.15 6.1,34.24 U2.8 6.17,34.27 C19.1 R12.2 | v5.4,19.58 5.84,19.14 C11.1 | S1.P$1 S1.P$3 | S1.P$3 25.58,20.78 R6.1 23.67,20.78 22.48,21.97 v22.48,22.61 | R18.1 v31.24,18.03 | v26.67,19.81 25.8,20.68 S1.P$3 | U1.24 3.58,23.77 v3.43,23.62 3.05,24 C14.1 | R11.2 11.73,33.42 12.01,33.71 12.01,35.61 R13.2 | R4.1 R5.1 2.94,34.8 3.35,34.39 3.35,29.77 v3.3,29.72
  Top 0.406: U1.43 12.71,21.64 v13.59,21.64 | U1.15 4.32,28.39 C13.1
  Top 0.508: U4.8 18.6,31.75 v16.51,31.75 | C25.1 14.83,29.44 v15.24,29.84 | v10.79,32.64 11.43,33.27 R11.2 | C7.1 v12.45,19.74 C16.1 | v13.59,21.64 13.79,21.64 14.17,21.26 C17.1 | C13.1 3.38,29.79 v3.3,29.72 | U4.1 17.57,36.22 v17.53,36.17
  Top 0.762: U5.4 33.57,5.33 C24.1 32.47,5.33 26.04,5.33 24.77,6.6 24.77,11.68 17.14,19.3 v16.13,19.3 | J9.1 v22.48,26.92 23.24,27.69 23.24,31.17 21.64,32.77 U4.8
  Bottom 0.254: v8.38,32 6.99,32 6.1,32.89 v6.1,33.15 | v3.43,23.62 2.54,22.73 2.54,21.46 4.42,19.58 v5.4,19.58 | v31.24,18.03 29.46,19.81 v26.67,19.81
  Bottom 0.508: v16.51,31.75 17.53,32.77 v17.53,36.17 | v16.51,31.75 11.68,31.75 v10.79,32.64 10.16,32 v8.38,32 7.37,30.99 4.57,30.99 v3.3,29.72 2.79,29.72 1.27,28.19 1.27,25.78 v3.43,23.62 | v16.13,19.3 15.7,19.74 | 15.7,19.74 v12.45,19.74 | v16.51,31.75 15.24,30.48 v15.24,29.84 | 15.7,19.74 13.79,21.64 v13.59,21.64
  Bottom 0.762: v16.13,19.3 19.18,19.3 v22.48,22.61 v22.48,26.92
5V0  (via drill 0.2)
  Top 0.305: U3.2
  Top 0.406: U3.2 25.39,34.68 v24.38,35.69 | R15.1 25.48,29.63 C20.1 C30.1 29.29,31.33 | U4.14 20.52,36.22 v20.55,36.25
  Top 0.508: U3.2 30.35,34.67 30.61,34.42 30.61,32.98 29.97,32.35 29.97,31.75 | R2.2 30.44,29.63 29.97,30.1 29.97,31.75 | 29.29,31.33 29.55,31.33 29.97,31.75
  Top 0.762: C33.1 29.84,10.93 29.84,25.02 30.99,26.16 | 30.99,26.16 R2.2 | R3.2 32.12,25.03 30.99,26.16
  Bottom 0.406: v24.38,35.69 21.11,35.69 v20.55,36.25
  pour Top (no thermals): 29.59,11.3 29.59,9.53 30.1,8.64 30.1,6.48 30.61,6.48 30.61,8.64 31.11,9.53 31.11,11.3
!ADE_CS  (via drill 0.2)
  Top 0.254: U1.53 13.94,26.77 16.38,29.21 16.38,30.48 14.15,32.72 14.15,34.59 15.49,35.94 16.51,35.94 | 16.51,35.94 16.96,35.49 U4.2 | 16.51,35.94 16.51,36.7 v16.76,36.96
  Bottom 0.254: v16.76,36.96 16.76,37.97 TP5.TESTPOINT
!ADE_CS_5V
  Top 0.254: U4.13 21.26,35.98 U3.17
!ADE_IRQ
  Top 0.254: U1.54 13.81,27.27 15.88,29.34 15.88,30.23 13.72,32.38 13.72,34.75 16.87,37.9 TP6.TESTPOINT 19.05,37.9 20.12,36.83 20.95,36.83 21.57,37.44 21.57,37.67 21.83,37.93 U3.14
!ADE_RESET
  Top 0.406: U3.1 27.68,34.03 25.4,31.75 R15.2
!FRAM_CS
  Top 0.254: R11.1 10.11,34.29 U2.1 | 10.13,34.01 U2.1 | U2.1 10.13,32.11 8.26,30.23 U1.8
!FRAM_HOLD
  Top 0.254: U1.13 5.76,30.56 4.06,32.26 4.06,35.81 4.37,36.12 R12.1 5.03,36.12 5.94,35.21 U2.7
!FRAM_WP
  Top 0.254: U2.3 10.17,36.19 10.34,36.19 11.2,37.06 R13.1 11.96,37.06 12.42,36.6 12.42,32.69 11.76,32.03 10.82,32.03 8.76,29.97 U1.7
!RESET  (via drill 0.2)
  Top 0.254: R10.1 3.23,22.91 v3.53,22.61 | v18.54,29.46 J9.6
  Bottom 0.254: v3.53,22.61 3.56,22.61 4.19,23.24 4.19,24.64 3.68,25.15 3.07,25.15 1.98,26.24 1.98,27.81 3,28.83 4.01,28.83 5,29.82 12.01,29.82 12.32,30.12 12.8,30.12 14.22,28.7 17.78,28.7 v18.54,29.46
ADE_AVDD
  Top 0.406: U3.3 30.71,35.33 31.24,34.8 31.24,34.2 C31.1 31.92,31.5 31.75,31.33 | R2.1 31.75,31.33 | 31.75,31.33 C21.1
ADE_CF
  Top 0.254: U1.6 9.26,29.71 11.05,31.5 11.96,31.5 12.85,32.38 12.85,35.13 17.27,39.55 20.02,39.55 | 20.02,39.55 21.23,39.55 21.57,39.88 U3.11 | TP8.TESTPOINT 20.52,40.06 20.02,39.55
ADE_ZX
  Top 0.254: U1.5 9.78,29.11 9.78,29.54 11.23,30.99 12.19,30.99 13.28,32.08 13.28,34.92 17.37,39.01 19.96,39.01 | 19.96,39.01 21.51,39.01 21.73,39.23 U3.12 | TP7.TESTPOINT 20.52,38.46 19.96,39.01
ANTENNA
  Top 0.5: B1.1 A1.1
BTLDR_CTRL  (via drill 0.2)
  Top 0.254: J9.5 22.1,29.46 22.48,29.08 22.48,28.32 v22.23,28.07 | v3.43,26.42 3.78,26.77 U1.18
  Bottom 0.254: v22.23,28.07 21.34,27.18 12.45,27.18 11.43,28.19 5.71,28.19 3.94,26.42 v3.43,26.42
BTLDR_RX  (via drill 0.2)
  Top 0.254: v19.05,28.7 19.56,28.19 J9.4 | U1.16 3.47,27.77 v3.43,27.81
  Bottom 0.254: v3.43,27.81 4.17,27.81 5.36,29.01 11.79,29.01 12.6,28.19 18.54,28.19 v19.05,28.7
BTLDR_TX  (via drill 0.2)
  Top 0.254: v21.84,28.83 J9.3 | U1.17 3.65,27.27 3.48,27.1 v3.02,27.1
  Bottom 0.254: v21.84,28.83 20.7,27.69 12.52,27.69 11.61,28.6 5.54,28.6 4.04,27.1 v3.02,27.1
DC_RECTIFIED
  Top 1.778: Q1.P$2 44.83,14.61 43.18,12.96 R23.2
  pour Top (no thermals): 58.45,13.97 56.9,15.49 56.9,17.91 51.05,17.91 51.05,11.18 56.9,11.18 56.9,12.06 63.3,12.06 63.27,13.89
GND  (via drill 0.2, 0.25, 0.51, 0.76)
  Top 0.254: C2.2 1.97,17.41 X1.2 1.97,18.6 3.12,19.75 X1.4 3.12,20.81 C1.2 | C12.2 7.72,32.49 8.26,33.02 | R14.1 24.64,18.92 v23.11,20.45
  Top 0.356: B1.5 7.87,16.89 | 7.87,16.89 7.37,16.89 6.99,17.27 C15.2 | B1.6 7.89,16.24 7.75,16.38 7.75,16.76 7.87,16.89 | B1.2 11.18,16.89 11.68,17.4 C16.2
  Top 0.508: v32.77,13.08 34.71,15.03 Q2.2
  Top 0.762: U5.3 36.58,6.6 U5.PAD | U5.2 34.52,7.58 C24.2 | C10.2 R9.1 46.48,35.31 46.23,35.56 | C9.2 51.82,35.05 51.31,35.56 46.23,35.56 | 35.3,40.02 C8.2 | C8.2 34.32,41.24 C32.2 | 46.23,35.56 42.04,35.56 39.5,38.1 37.45,38.1 C8.2
  Top 1.524: L4.P$2 70.71,21.8 70.71,12.68 v64.26,6.22
  Top 1.778: v26.29,12.95 v20.95,18.29
  other vias: 18.54,35.18 19.56,35.18 19.56,34.16 18.54,34.16 8.51,25.02 9.78,25.02 11.05,25.02 11.05,26.29 11.05,27.56 9.78,27.56 9.78,26.29 8.51,26.29 8.51,27.56 7.24,27.56 5.97,27.56 5.97,26.29 7.24,26.29 7.24,25.02 7.24,23.75 7.24,22.48 8.51,22.48 9.78,22.48 11.05,22.48 11.05,23.75 9.78,23.75 8.51,23.75 5.97,25.02 5.97,23.75 5.97,22.48 3.81,21.08 0.89,21.72 4.83,32.51 11.53,30.4 8.64,32.89 24.13,34.04 27.43,40.01 24.89,39.88 27.43,37.97 24.89,38.35 27.43,35.94 32.77,32.51 33.91,32.38 44.96,1.4 46.86,3.05 49.53,3.05 52.32,3.05 49.53,1.27 51.18,7.49 53.21,7.49 51.18,9.4 54.23,9.65 54.36,1.4 64.26,4.32 64.26,2.41 34.54,2.67 32.77,9.78 32.77,11.43 27.81,12.95 36.58,8.38 37.85,8.38 37.85,7.24 36.58,7.24 37.85,6.1 36.58,6.1 5.21,17.09 6.4,17.09 16.26,32.77 19.1,36.88 0.89,17.4 8,45.09 8,43.81 13.34,37.08 15.24,32.77 8,42.42 5.21,39.75 24,45.72 24,43.43 13.79,40.89 15.7,46.23 21.72,19.56 17.14,17.4 15.62,17.4 12.57,17.27 57.53,5.71 56.52,9.65 18.16,20.19 3.94,31.52 1.04,36.37 2.49,36.37 0.91,24.82 18.92,26.26 18.08,23.16 21.01,22.71 17.42,30.91 17.42,29.9 0.89,28.96
  pour Top: -1.27,48.26 34.29,48.26 34.29,39.12 29.08,39.12 29.08,35.56 34.29,35.56 34.29,28.32 24.13,28.32 24.13,20.32 20.07,16.76 11.3,16.76 11.3,21.59 7.75,21.59 7.75,16.76 -1.27,16.76
  pour Bottom: -1.27,14.73 17.78,14.73 24.13,20.32 24.13,28.32 34.29,28.32 34.29,35.56 29.08,35.56 29.08,39.12 34.29,39.12 34.29,48.26 -1.27,48.26
  pour Bottom: 67.31,-1.27 67.31,13.97 25.4,13.97 25.4,-1.27
  pour Top: 65.53,-1.27 65.53,8.13 59.18,8.13 59.18,10.67 50.16,10.67 50.16,4.06 44.07,4.06 44.07,2.79 41.4,2.79 41.4,-1.27
  pour Top: 33.02,4.95 33.02,2.29 38.99,2.29 38.99,3.43 40.26,4.83 40.26,5.59 38.48,5.59 38.48,9.65 35.94,9.65 35.94,8.38 33.66,8.38 33.66,13.97 31.75,13.97 31.75,5.97 28.7,5.97 28.7,13.97 25.4,13.97 25.4,-1.27 29.21,-1.27 29.21,4.95
GREEN_LED
  Top 0.254: U1.22 3.96,24.77 2.39,26.34 2.39,31.1 D5.C
LOAD_NEUTRAL
  Top 2.032: R1.2 63.11,37.47 55.24,37.47 52.7,40.01 | L3.P$1 40.01,44.77 40.01,40.13 42.8,37.34 50.04,37.34 52.7,40.01 | 52.7,40.01 J4.P$1
LOAD_PHASE
  Bottom 2.54: K1.1 41.77,32.49 45.59,36.32 J3.P$1
MISO  (via drill 0.2)
  Top 0.254: v11.43,35.18 10.17,35.18 U2.2 9.66,35.21 9.42,34.98 9.42,32.16 7.76,30.49 U1.9 | U4.4 16.1,34.49 v16.03,34.42
  Bottom 0.254: v11.43,35.18 12.19,34.42 v16.03,34.42 16.38,34.77 16.38,35.56 13.97,37.97 11.43,37.97 TP3.TESTPOINT
MISO_5V
  Top 0.254: U4.11 21.44,34.49 21.63,34.68 U3.19
MOSI  (via drill 0.2)
  Top 0.254: 6.83,32.89 6.83,36.88 6.6,37.11 U2.5 | U1.11 6.76,29.69 6.83,29.76 6.83,32.89 | v7.75,33.4 7.34,33.4 6.83,32.89 | U4.5 16.72,33.99 v16.38,33.66
  Bottom 0.254: v7.75,33.4 8,33.66 v16.38,33.66 16.89,34.16 16.89,35.94 13.46,39.37 TP2.TESTPOINT
MOSI_5V
  Top 0.254: U4.10 22.5,33.99 U3.20
N$1  (via drill 0.2)
  Top 0.254: U1.32 6.76,20.48 6.48,20.19 4.95,20.19 4.7,19.94 | U1.56 13.36,29.05 C26.1 12.6,29.44 v12.57,29.46 | 4.7,19.94 C27.1 | 4.7,19.94 4.7,20.32 v4.45,20.57
  Bottom 0.254: v4.45,20.57 4.83,20.95 4.83,24.77 3.94,25.65 3.17,25.65 2.39,26.44 2.39,27.61 3.2,28.42 4.19,28.42 5.18,29.41 12.5,29.41 v12.57,29.46
N$2
  Top 0.254: U1.28 2.79,21.77 R10.2 C18.1
N$3
  Top 0.305: X3.1 19.65,44.06
  Top 0.406: U3.15 23.57,37.28 23.88,37.59 23.88,40.89 20.32,44.45 X3.1 19.38,44.18 C6.1
N$4
  Top 0.762: D3.1 32.83,18.18 Q2.3 33.84,17.29 K1.4
N$6
  Top 0.254: U1.45 16.21,22.77 X2.2 16.88,22.1 C4.1
N$7
  Top 0.254: C3.1 16.39,21.08 | 16.39,21.08 X2.1 | 16.39,21.08 15.88,21.08 14.69,22.27 U1.44
N$8
  Top 0.254: R17.1 13.64,20.45 12.26,20.45 U1.42
N$9  (via drill 0.2)
  Top 0.254: C1.1 1.97,20.81 X1.1 1.93,19.94 v1.02,19.94 | v7.54,19.74 7.76,19.95 U1.34
  Bottom 0.254: v1.02,19.94 2.92,19.94 3.94,18.92 6.73,18.92 v7.54,19.74
N$10  (via drill 0.2)
  Top 0.254: X1.3 3.12,17.41 C2.1 3.23,17.53 v3.79,17.53 | U1.35 8.26,19.33 v8.15,19.23
  Bottom 0.254: v8.15,19.23 7.21,18.29 4.55,18.29 v3.79,17.53
N$11
  Top 0.406: C32.1 C22.1 31.19,39.23 U3.9
N$12
  Top 0.254: D6.A R6.2
N$13
  Top 0.762: R3.1 D3.3 35.37,21.42 K1.3
N$14
  Top 0.762: R8.1 55.49,34.42 L2.P$2
N$15
  Top 0.406: U3.16 24.82,36.63 25.91,37.72 25.91,41.48 X3.2 32.3,44.45 C5.1
N$16
  Top 0.762: L3.P$2 35.75,42.74 R7.1
N$17
  Top 0.762: L1.2 49.15,29.83 R22.1
N$18
  Top 1.016: R20.1 R21.2
N$20
  Top 0.254: R4.2 D4.A
N$21
  Top 1.778: R23.1 R24.2
N$22
  Top 0.254: D5.A R5.2
N$24
  Top 0.762: C23.2 41.87,7.87 U5.7
N$26
  Top 0.508: U5.5 38.1,3.82 | 38.1,3.82 R16.2 | R19.1 38.52,3.4 38.1,3.82
RED_LED
  Top 0.254: U1.23 3.82,24.27 1.96,26.14 1.96,30.36 D4.C
RELAY_CTRL  (via drill 0.2)
  Top 0.254: 32.71,15.15 32.64,15.22 v32.64,16.26 | v28.45,16.26 26.29,16.26 17.28,25.27 U1.50
  Top 0.762: Q2.1 32.71,15.15 R18.2
  Bottom 0.254: v28.45,16.26 v32.64,16.26
RELAY_LED
  Top 0.254: D6.C 22.38,24.28 21.59,23.5 19.81,23.5 17.54,25.77 U1.51
RF_N
  Top 0.254: U1.38 9.76,17.67 9.89,17.54 B1.3
RF_P
  Top 0.254: U1.37 9.26,17.67 9.12,17.53 9.1,17.54 B1.4
SCLK  (via drill 0.2)
  Top 0.254: U1.12 6.26,31.59 v5.97,31.88 | v5.05,36.93 5.82,36.16 U2.6 | U4.3 16.52,34.99 16.33,35.18 v15.67,35.18
  Bottom 0.254: v15.67,35.18 13.08,35.18 12.06,36.2 5.79,36.2 v5.05,36.93 | v5.97,31.88 5.46,32.38 5.46,36.52 v5.05,36.93 | v5.05,36.93 7.37,39.24 TP4.TESTPOINT
SCLK_5V
  Top 0.254: U4.12 21.3,34.99 21.64,35.33 U3.18
SR086_GATE  (via drill 0.51)
  Top 0.762: Q1.P$1 44.21,16.91 v42.93,15.62 | U5.8 42.04,9.14 v42.93,10.03
  Bottom 0.762: v42.93,15.62 v42.93,10.03
SR086_VIN
  pour Top (no thermals): 35.94,12.57 34.16,12.57 34.16,8.89 35.43,8.89 35.43,9.53 35.94,11.05
TCK
  Top 0.254: TP14.TP 13.89,23.77 U1.47
TDO
  Top 0.254: U1.48 12.99,24.27 13.49,24.77 16.59,24.77 17.07,24.28 TP13.TP
TMS
  Top 0.254: U1.46 13.23,23.27 13.31,23.19 15.27,23.19 15.57,23.5 TP12.TP
USER_RELAY_CTRL
  Top 0.254: U1.52 17.8,26.27 20.02,24.05 21.39,24.05 24.77,27.43 26.8,27.43 27.58,26.65 S1.P$2 S1.P$4 27.52,20.93 R14.2
V1N
  Top 0.406: C9.1 50.92,32.38 48.26,32.38 46.35,30.48 36.07,30.48 35.05,31.5 35.05,33.4 36.32,34.67 36.32,35.43 TP10.TESTPOINT 33.91,37.85 31.55,37.85 30.99,37.28 | 30.99,37.28 U3.6 | U3.5 30.34,36.63 30.99,37.28
  Top 0.762: C9.1 R8.2
V1P  (via drill 0.41)
  Top 0.406: v38.1,39.12 37.09,40.12 C8.1 | U3.4 31.54,35.98 | TP9.TESTPOINT 31.54,35.98 | 31.54,35.98 33.87,35.98 34.8,35.05 v35.18,35.05
  Top 0.762: R7.2 C8.1
  Bottom 0.406: v38.1,39.12 36.45,37.47 36.45,36.32 v35.18,35.05
V2P
  Top 0.406: C10.1 43.32,32.5 39.12,36.7 TP11.TESTPOINT 37.21,36.7 35.31,38.61 31.24,38.61 30.57,37.93 U3.7
  Top 0.762: C10.1 R9.2 47.27,33.28 R22.2
VDC
  pour Top (no thermals): 48.39,13.34 48.39,4.57 43.43,4.57 43.43,3.43 40.89,3.43 40.89,0.89 29.97,0.89 29.97,3.43 31.5,4.32 32.51,4.32 32.51,1.78 39.5,1.78 39.5,3.17 40.89,4.57 40.89,6.22 38.99,6.22 38.99,6.99 43.05,6.99 43.05,8.26 44.96,8.26 44.96,13.34
WALL_NEUTRAL
  Top 1.524: L4.P$1 70.08,26.2 J5.NEUTRAL1
  Top 2.032: 65.33,25.6 D1.CATHODE 65.28,28.06 J5.NEUTRAL1 | L2.P$1 63.62,34.42 R1.1 64.64,31.63 J5.NEUTRAL1 | J5.NEUTRAL2 J5.NEUTRAL1
WALL_PHASE
  Top 1.27: L1.1 38.5,28.96 K1.2
  Top 1.524: D2.ANNODE 66.08,16.87 J5.PHASE1
  Top 2.032: D1.ANODE 65.28,19.01 J5.PHASE1 J5.PHASE2
  Bottom 2.032: 37.99,26.4 K1.2
  Bottom 2.54: K1.2 46.83,17.54 J5.PHASE2

### Text on the board
tPlace: CLK | MI | MO | !ACS | CF | ZX | P | N | GND | !IRQ | V1P | VN | BLK | WHT | V2P | N | TCK | TMS | TDO | RELAY / CTRL | GRN | E | P | + | B | + | AC | me | Brad Campbell | 2014/08/20